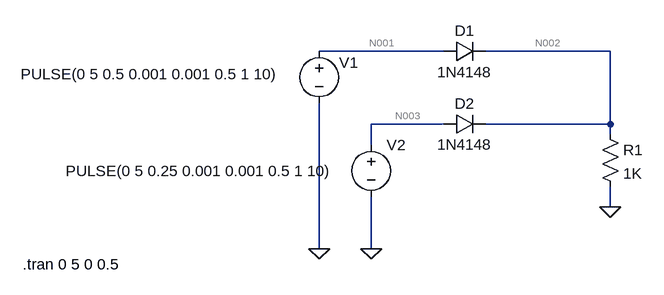
[diagram p0: schematic Porte_logique_ou_Diode.asc]
Porte_logique_ou_Diode.asc, the LTspice schematic file:
Version 4.1
SHEET 1 880 680
WIRE 96 96 -96 96
WIRE 352 96 160 96
WIRE 96 208 -16 208
WIRE 352 208 352 96
WIRE 352 208 160 208
WIRE 352 224 352 208
WIRE -16 240 -16 208
WIRE 352 336 352 304
WIRE -96 400 -96 176
WIRE -16 400 -16 320
FLAG 352 336 0
FLAG -16 400 0
FLAG -96 400 0
SYMBOL diode 96 112 R270
WINDOW 0 32 32 VTop 2
WINDOW 3 0 32 VBottom 2
SYMATTR InstName D1
SYMATTR Value 1N4148
SYMBOL diode 96 224 R270
WINDOW 0 32 32 VTop 2
WINDOW 3 0 32 VBottom 2
SYMATTR InstName D2
SYMATTR Value 1N4148
SYMBOL res 336 208 R0
SYMATTR InstName R1
SYMATTR Value 1K
SYMBOL voltage -96 80 R0
WINDOW 0 60 33 Right 2
WINDOW 3 -459 51 Left 2
WINDOW 123 0 0 Left 0
WINDOW 39 0 0 Left 0
SYMATTR InstName V1
SYMATTR Value PULSE(0 5 0.5 0.001 0.001 0.5 1 10)
SYMBOL voltage -16 224 R0
WINDOW 3 -470 56 Left 2
WINDOW 123 0 0 Left 0
WINDOW 39 0 0 Left 0
SYMATTR Value PULSE(0 5 0.25 0.001 0.001 0.5 1 10)
SYMATTR InstName V2
TEXT -552 424 Left 2 !.tran 0 5 0 0.5

The netlist it stands for:
* Porte_logique_ou_Diode.asc
D1 N001 N002 1N4148
D2 N003 N002 1N4148
R1 N002 0 1K
V1 N001 0 PULSE(0 5 0.5 0.001 0.001 0.5 1 10)
V2 N003 0 PULSE(0 5 0.25 0.001 0.001 0.5 1 10)
.model D D
.lib standard.dio
.tran 0 5 0 0.5
.backanno
.end

* Results of the author's LTspice run, read from the files saved beside the schematic
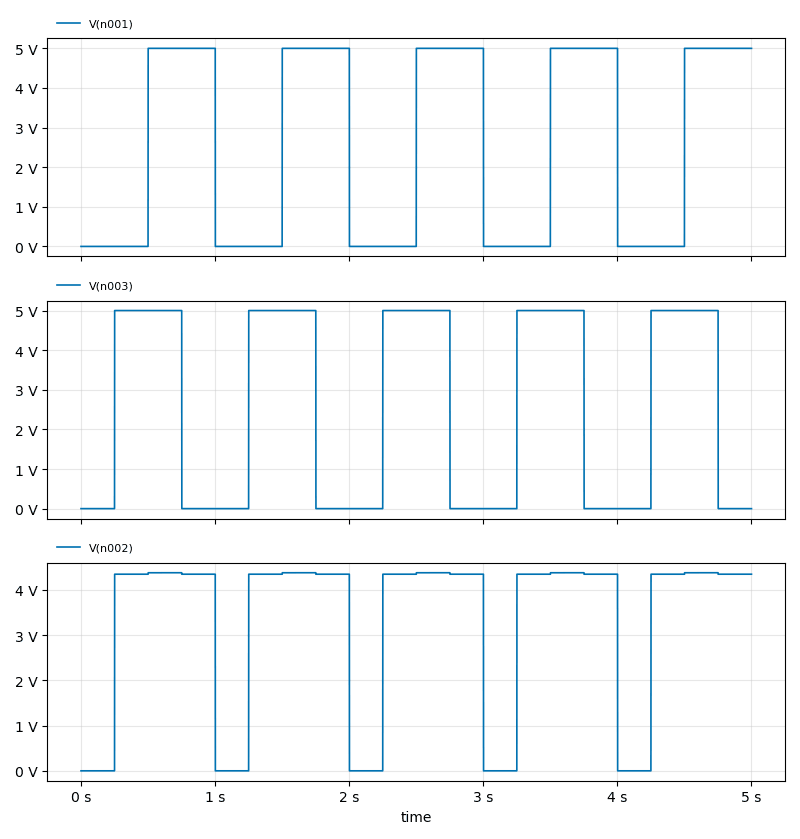
[diagram p1: Transient Analysis of Porte_logique_ou_Diode.asc, plotted from the saved traces]
* Transient Analysis, 1 run:
*   V(n001): min 0 V, max 5 V, average 2.503 V, rms 3.537 V, last 5 V
*   V(n003): min 0 V, max 5 V, average 2.505 V, rms 3.538 V, last 0 V
*   V(n002): min 0 V, max 4.379 V, average 3.271 V, rms 3.775 V, last 4.347 V